# EAGLE design AVR28ZIF (EAGLE 6.5.0)
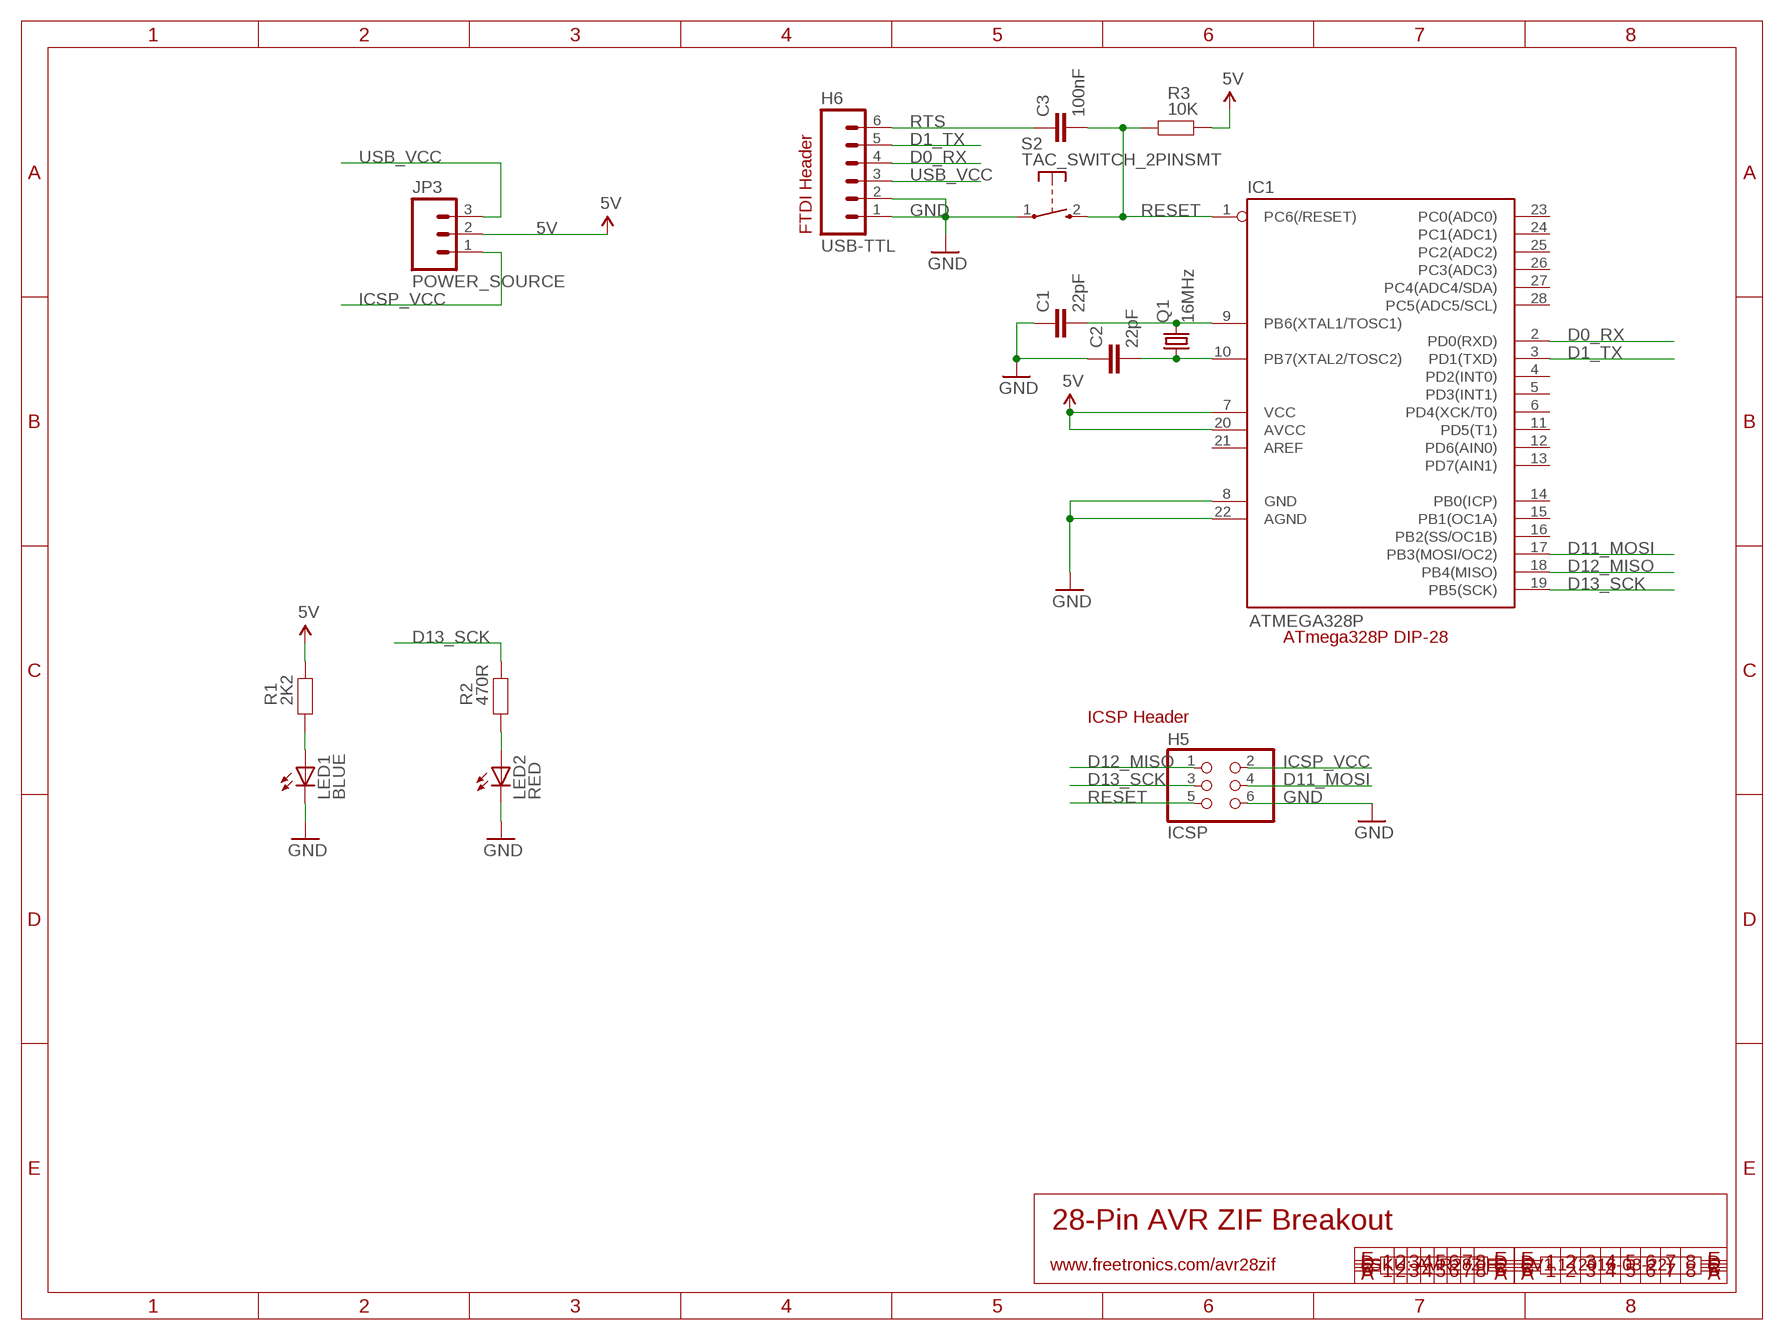
[diagram p0: schematic, sheet 1]

## Parts
C1  22pF  CAP0603  [0603]
C2  22pF  CAP0603  [0603]
C3  100nF  CAP0603  [0603]
H5  ICSP  PINHD-2X3  [2X03]
H6  USB-TTL  M06SIP  [1X06]
IC1  ATMEGA328P  AVR-MEGA8-PZIF  [DIL28-3-ZIF]
JP3  POWER_SOURCE  M03PTH  [1X03]
LED1  BLUE  LED0603  [LED-0603]
LED2  RED  LED0603  [LED-0603]
Q1  16MHz  CRYSTALHC49US  [HC49US]
R1  2K2  RESISTOR0603  [0603]
R2  470R  RESISTOR0603  [0603]
R3  10K  RESISTOR0603  [0603]
S2  TAC_SWITCH_2PINSMT  [TACTILE_SWITCH_SMD_2PIN_TINY]

## Nets
5V: IC1.7(VCC) IC1.20(AVCC) JP3.2 R1.2 R3.2
D0_RX: H6.4 IC1.2(PD0(RXD))
D1_TX: H6.5 IC1.3(PD1(TXD))
D11_MOSI: H5.4 IC1.17(PB3(MOSI/OC2))
D12_MISO: H5.1 IC1.18(PB4(MISO))
D13_SCK: H5.3 IC1.19(PB5(SCK)) R2.2
GND: C1.1 C2.1 H5.6 H6.1 H6.2 IC1.8(GND) IC1.22(AGND) LED1.C LED2.C S2.1(P)
ICSP_VCC: H5.2 JP3.1
N$1: C1.2 IC1.9(PB6(XTAL1/TOSC1)) Q1.2
N$2: C2.2 IC1.10(PB7(XTAL2/TOSC2)) Q1.1
N$3: LED1.A R1.1
N$4: LED2.A R2.1
RESET: C3.2 H5.5 IC1.1(PC6(/RESET)) R3.1 S2.2(S)
RTS: C3.1 H6.6
USB_VCC: H6.3 JP3.3
Unconnected: IC1.4(PD2(INT0)) IC1.5(PD3(INT1)) IC1.6(PD4(XCK/T0)) IC1.11(PD5(T1)) IC1.12(PD6(AIN0)) IC1.13(PD7(AIN1)) IC1.14(PB0(ICP)) IC1.15(PB1(OC1A)) IC1.16(PB2(SS/OC1B)) IC1.21(AREF) IC1.23(PC0(ADC0)) IC1.24(PC1(ADC1)) IC1.25(PC2(ADC2)) IC1.26(PC3(ADC3)) IC1.27(PC4(ADC4/SDA)) IC1.28(PC5(ADC5/SCL))

## Notes on the sheet
- FTDI Header
- ATmega328P DIP-28
- ICSP Header
- 28-Pin AVR ZIF Breakout
- www.freetronics.com/avr28zif | SKU: AVR28ZIF | V1.1 (2016-03-22)

## Library data of the parts
C1-C3 = freetronics-jon:CAP: Capacitor Standard 0603 ceramic capacitor, and 0.1" leaded capacitor.
H5 = pinhead:PINHD-2X3: PIN HEADER
H6 = freetronics:M06: Header 6 Standard 6-pin 0.1" header. Use with straight break away headers (SKU : PRT-00116), right angle break away headers (PRT-00553), swiss pins (PRT-00743), machine pins (PRT-00117), and female headers (PRT-00115). Molex polarized connector foot print use with SKU : PRT-08094 with associated crimp pins and housings. NOTES ON THE VARIANTS LOCK and LOCK_LONGPADS... This footprint was designed to help hold the alignment of a through-hole component (i.e. 6-pin header) while soldering it into place. You may notice that each hole has been shifted either up or down by 0.005 of an inch from it's more standard position (which is a perfectly straight line). This slight alteration caused the pins (the squares in the middle) to touch the edges of the holes. Because they are alternating, it causes a "brace" to hold the component in place. 0.005 has proven to be the perfect amount of "off-center" position when using our standard breakaway headers. Although looks a little odd when you look at the bare footprint, once you have a header in there, the alteration is very hard to notice. Also, if you push a header all the way into place, it is covered up entirely on the bottom side. This idea of altering the position of holes to aid alignment will be further integrated into the Sparkfun Library for other footprints. It can help hold any component with 3 or more connection pins.
IC1 = freetronics-original:AVR-MEGA8-P: MICROCONTROLLER 8 Kbytes FLASH 1 kbytes SRAM 512 bytes EEPROM USART 4-channel 10 bit ADC 2-channel 8 bit ADC
JP3 = freetronics-jon:M03: Header 3 Standard 3-pin 0.1" header. Use with straight break away headers (SKU : PRT-00116), right angle break away headers (PRT-00553), swiss pins (PRT-00743), machine pins (PRT-00117), and female headers (PRT-00115). Molex polarized connector foot print use with SKU : PRT-08232 with associated crimp pins and housings.
LED1 LED2 = freetronics-jon:LED: LEDs Standard schematic elements and footprints for 5mm, 3mm, 1206, and 0603 sized LEDs. 5mm - Spark Fun Electronics SKU : COM-00529 (and others)
Q1 = freetronics-jon:CRYSTAL: Crystals Various standard crystals. Proven footprints. Spark Fun Electronics SKU : COM-00534
R1-R3 = freetronics-jon:RESISTOR: Resistor Basic schematic elements and footprints for 0603, 1206, and PTH 1/10th watt (small) resistors.
S2 = freetronics-jon:TAC_SWITCH_2PIN: Momentary Tactile Switch - 2 pin

## Board
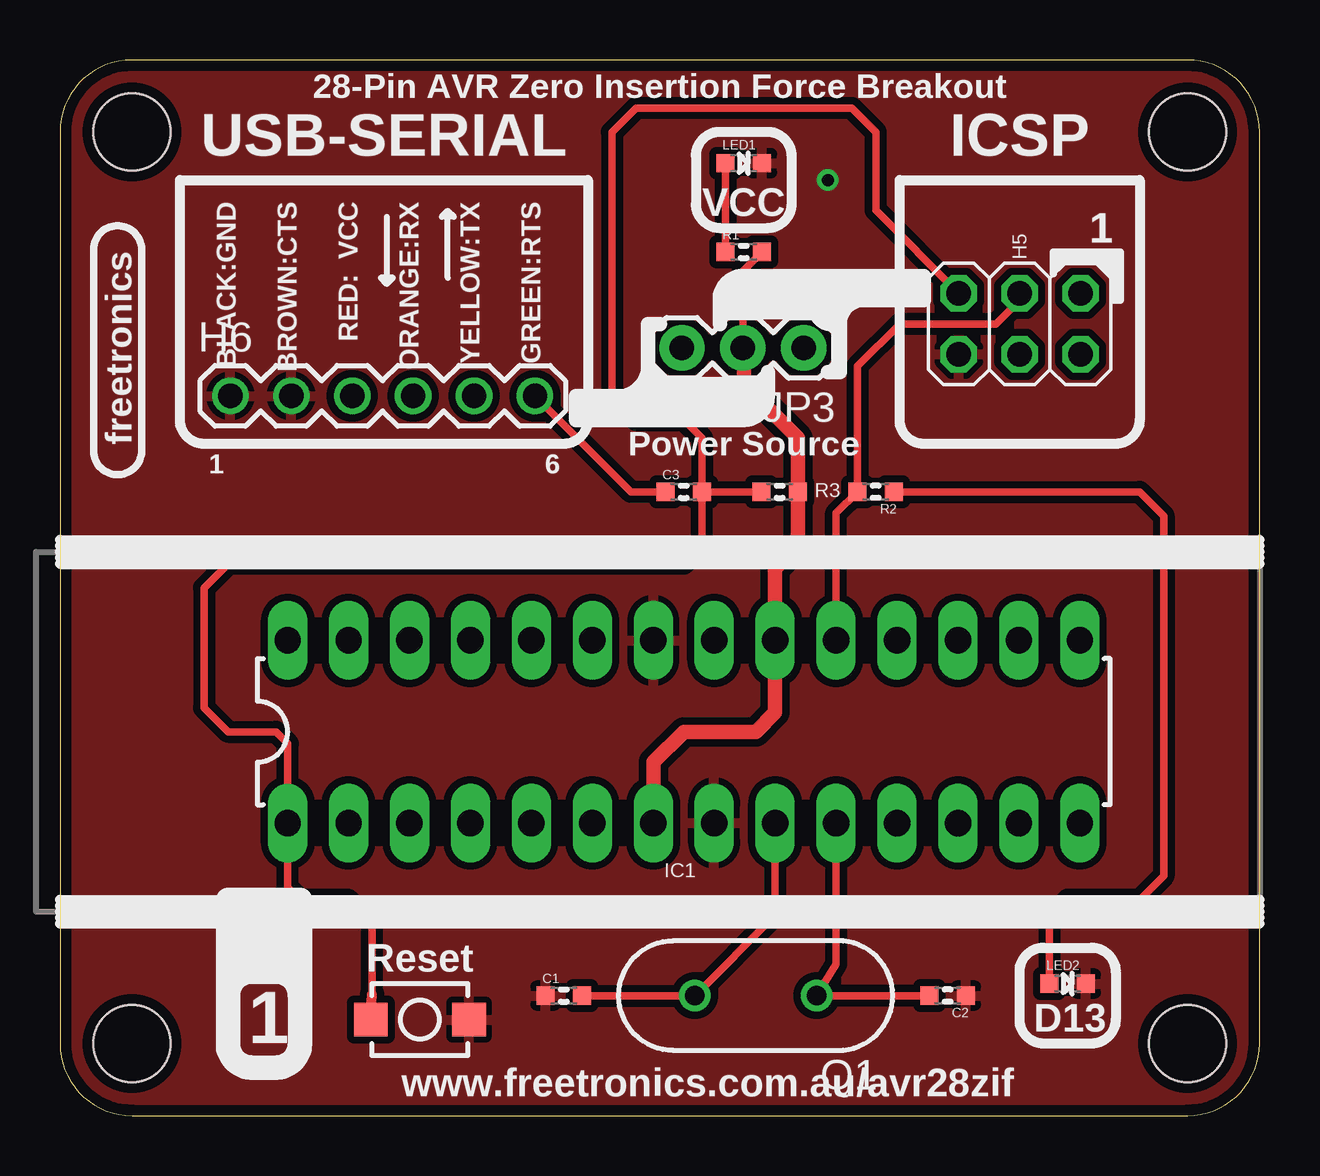
[diagram p1: board, top side]
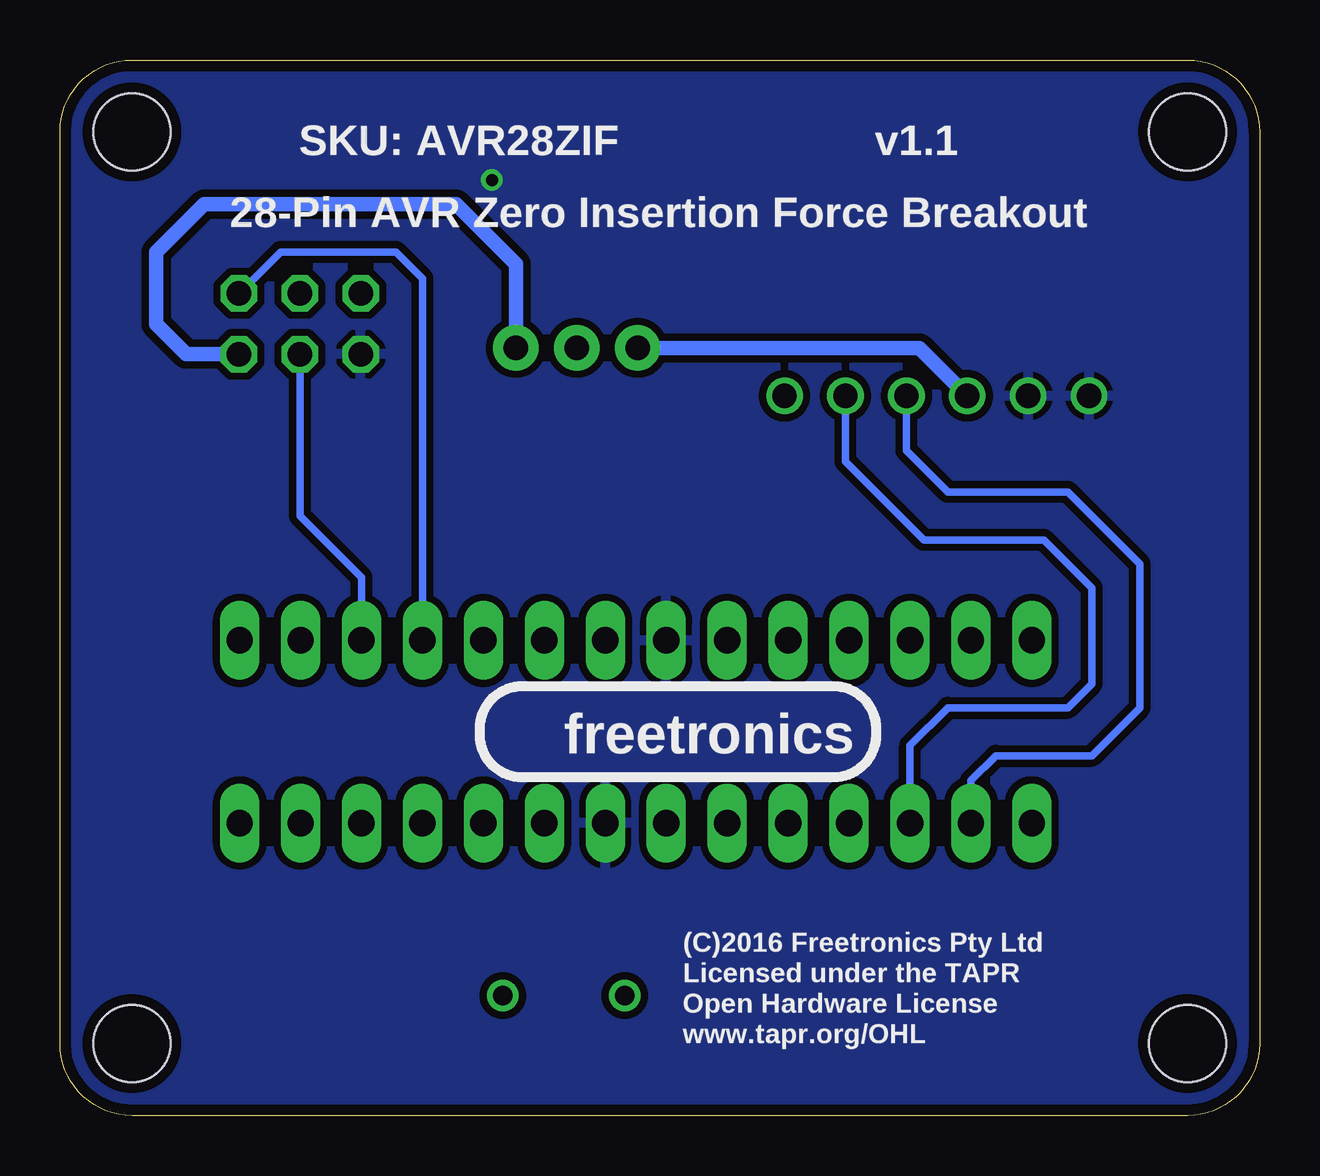
[diagram p2: board, bottom side, seen from below]

Size 50 x 44 mm. Coordinates in mm from the lower left corner, seen from the top.
Outline: 0,3 arc90 3,0 47,0 arc90 50,3 50,41 arc90 47,44 3,44 arc90 0,41 0,3
Copper layers (1*16): Top 0.035mm / dielectric 1.5mm / Bottom 0.035mm
Design rules "default *": minimum track width 10mil, minimum drill 18mil, track to track 10mil, track to pad 10mil, pad to pad 10mil, via to via 10mil, smd to smd 8mil, copper to edge 18mil, drill to drill 8mil, minimum pad ring 10mil, minimum via ring 8mil, stop-mask expansion 4mil, vias tented up to drill 25mil, thermal gap 10mil
Holes 3.2 mm at 47,41 47,3 3,41 3,3

### Footprints (pad centres in the part's own frame; a part is rotated, then mirrored left to right if it is on the bottom)
0603 = smd 0.762 x 0.762: 1 -0.762,0; 2 0.762,0
2X03 = drill 1.016 octagon: 1 -2.54,-1.27; 2 -2.54,1.27; 3 0,-1.27; 4 0,1.27; 5 2.54,-1.27; 6 2.54,1.27
1X06 = drill 1.016: 1 0,0; 2 2.54,0; 3 5.08,0; 4 7.62,0; 5 10.16,0; 6 12.7,0
DIL28-3-ZIF = drill 1.1 long: 1 -16.51,-3.81; 2 -13.97,-3.81; 3 -11.43,-3.81; 4 -8.89,-3.81; 5 -6.35,-3.81; 6 -3.81,-3.81; 7 -1.27,-3.81; 8 1.27,-3.81; 9 3.81,-3.81; 10 6.35,-3.81; 11 8.89,-3.81; 12 11.43,-3.81; 13 13.97,-3.81; 14 16.51,-3.81; 15 16.51,3.81; 16 13.97,3.81; 17 11.43,3.81; 18 8.89,3.81; 19 6.35,3.81; 20 3.81,3.81; 21 1.27,3.81; 22 -1.27,3.81; 23 -3.81,3.81; 24 -6.35,3.81; 25 -8.89,3.81; 26 -11.43,3.81; 27 -13.97,3.81; 28 -16.51,3.81
1X03 = drill 1.016 pad 1.88: 1 0,0; 2 2.54,0; 3 5.08,0
LED-0603 = smd 0.762 x 0.762: A -0.762,0; C 0.762,0
HC49US = drill 0.813: 1 -2.54,0; 2 2.54,0
TACTILE_SWITCH_SMD_2PIN_TINY = smd 1.4 x 1.4: 1 -2.05,0; 2 2.05,0

### Placement (x,y rotation side)
C1  21,5 0 top
C2  37,5 180 top
C3  26,26 0 top
H5  40,33 180 top
H6  7.1,30 0 top
IC1  26,16 0 top
JP3  31,32 180 top
LED1  28.5,39.7 0 top
LED2  42,5.5 0 top
Q1  29,5 180 top
R1  28.5,36 0 top
R2  34,26 180 top
R3  30,26 0 top
S2  15,4 180 top

### Tracks (layer width: path | path; a pad name or v marks a point on that pad's centre or on a via)
5V
  Top 0.305: R1.2 28.46,35.2 JP3.2
  Top 0.61: IC1.7 24.73,14.73 26,16 29,16 29.81,16.81 IC1.20 29.81,22.81 30.76,23.76 R3.2 30.76,28.24 28.5,30.5 28.5,31.96 JP3.2
D0_RX
  Bottom 0.305: H6.4 14.72,27.72 13,26 8,26 5,23 5,17 7,15 11,15 12.03,13.97 IC1.2
D1_TX
  Bottom 0.305: H6.5 17.26,27.26 14,24 9,24 7,22 7,18 8,17 13,17 14.57,15.43 IC1.3
D11_MOSI
  Bottom 0.305: IC1.17 37.43,22.43 40,25 H5.4
D12_MISO
  Bottom 0.305: IC1.18 34.89,34.89 36,36 40.81,36 H5.1
D13_SCK
  Top 0.305: IC1.19 32.35,25.11 R2.2 33.24,31.24 35,33 39,33 40,34 H5.3
GND  (via drill 0.5)
  other vias: 32,39
  pour Bottom (isolate 0.305): 0,41 arc-90 3,44 47,44 arc-90 50,41 50,3 arc-90 47,0 3,0 arc-90 0,3
  pour Top (isolate 0.305): 0,41 arc-90 3,44 47,44 arc-90 50,41 50,3 arc-90 47,0 3,0 arc-90 0,3
ICSP_VCC
  Bottom 0.61: JP3.1 31,35.5 33.5,38 44,38 46,36 46,33 44.73,31.73 H5.2
N$1
  Top 0.305: C1.2 Q1.2 29.81,8.35 IC1.9
N$2
  Top 0.305: C2.2 Q1.1 32.35,6.31 IC1.10
N$3
  Top 0.305: LED1.A R1.1
N$4
  Top 0.305: R2.1 45,26 46,25 46,10 45,9 42,9 41.24,8.24 LED2.A
RESET
  Top 0.305: 13,5.05 13,8 12,9 10,9 9.49,9.51 IC1.1 9.49,15.51 9,16 7,16 6,17 6,22 7,23 26,23 26.76,23.76 C3.2 | C3.2 R3.1 | H5.5 34,37.73 34,41 33,42 24,42 23,41 23,30 24,29 26,29 26.76,28.24 C3.2
  Top 0.406: S2.2 13,5.05
RTS
  Top 0.305: C3.1 23.8,26 H6.6
USB_VCC
  Bottom 0.61: JP3.3 14.18,32 H6.3

### Text on the board
tPlace: 28-Pin AVR Zero Insertion Force Breakout | USB-SERIAL | ICSP | BLACK:GND | BROWN:CTS | RED: VCC | ORANGE:RX | YELLOW:TX | GREEN:RTS | VCC | 1 | freetronics | Power Source | 1 | 6 | Reset | D13 | 1 | www.freetronics.com.au/avr28zif
bPlace: v1.1 | SKU: AVR28ZIF | 28-Pin AVR Zero Insertion Force Breakout | freetronics | (C)2016 Freetronics Pty Ltd | Licensed under the TAPR | Open Hardware License | www.tapr.org/OHL